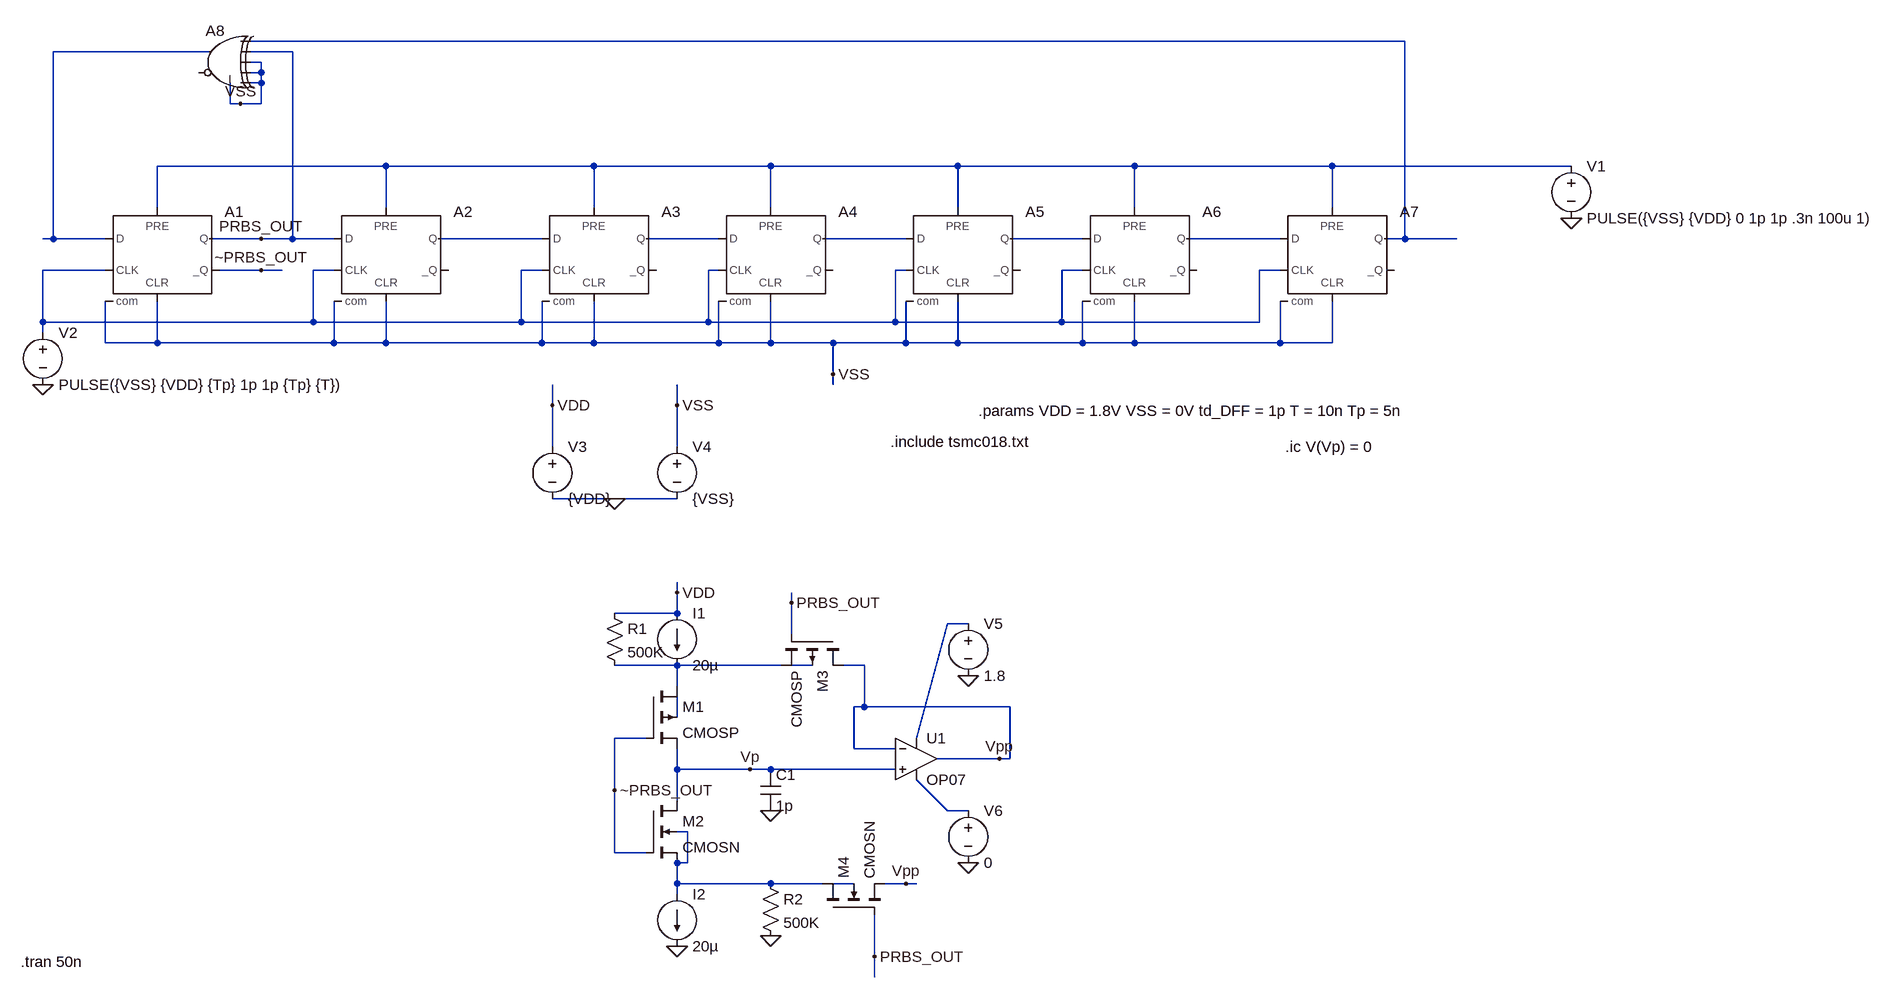
[diagram p0: schematic Current_Mode_Integrator1.asc]
Current_Mode_Integrator1.asc, the LTspice schematic file:
Version 4
SHEET 1 2280 1356
WIRE 1520 -160 -256 -160
WIRE -320 -144 -560 -144
WIRE -192 -144 -256 -144
WIRE -240 -128 -256 -128
WIRE -240 -112 -240 -128
WIRE -240 -112 -256 -112
WIRE -240 -96 -240 -112
WIRE -240 -96 -256 -96
WIRE -288 -64 -288 -96
WIRE -272 -64 -288 -64
WIRE -240 -64 -240 -96
WIRE -240 -64 -272 -64
WIRE -48 32 -400 32
WIRE 272 32 -48 32
WIRE 544 32 272 32
WIRE 832 32 544 32
WIRE 1104 32 832 32
WIRE 1408 32 1104 32
WIRE 1776 32 1408 32
WIRE -400 96 -400 32
WIRE -48 96 -48 32
WIRE 272 96 272 32
WIRE 544 96 544 32
WIRE 832 96 832 32
WIRE 1104 96 1104 32
WIRE 1408 96 1408 32
WIRE -560 144 -560 -144
WIRE -560 144 -576 144
WIRE -480 144 -560 144
WIRE -240 144 -320 144
WIRE -192 144 -192 -144
WIRE -192 144 -240 144
WIRE -128 144 -192 144
WIRE 192 144 32 144
WIRE 464 144 352 144
WIRE 752 144 624 144
WIRE 1024 144 912 144
WIRE 1328 144 1184 144
WIRE 1520 144 1520 -160
WIRE 1520 144 1488 144
WIRE 1600 144 1520 144
WIRE -480 192 -576 192
WIRE -240 192 -304 192
WIRE -208 192 -240 192
WIRE -128 192 -160 192
WIRE 192 192 160 192
WIRE 464 192 448 192
WIRE 752 192 736 192
WIRE 1024 192 992 192
WIRE 1328 192 1296 192
WIRE -576 272 -576 192
WIRE -160 272 -160 192
WIRE -160 272 -576 272
WIRE 160 272 160 192
WIRE 160 272 -160 272
WIRE 448 272 448 192
WIRE 448 272 160 272
WIRE 736 272 736 192
WIRE 736 272 448 272
WIRE 992 272 992 192
WIRE 992 272 736 272
WIRE 1296 272 1296 192
WIRE 1296 272 992 272
WIRE -576 288 -576 272
WIRE -480 304 -480 240
WIRE -400 304 -400 240
WIRE -400 304 -480 304
WIRE -128 304 -128 240
WIRE -128 304 -400 304
WIRE -48 304 -48 240
WIRE -48 304 -128 304
WIRE 192 304 192 240
WIRE 192 304 -48 304
WIRE 272 304 272 240
WIRE 272 304 192 304
WIRE 464 304 464 240
WIRE 464 304 272 304
WIRE 544 304 544 240
WIRE 544 304 464 304
WIRE 640 304 544 304
WIRE 752 304 752 240
WIRE 752 304 640 304
WIRE 832 304 832 240
WIRE 832 304 752 304
WIRE 1024 304 1024 240
WIRE 1024 304 832 304
WIRE 1104 304 1104 240
WIRE 1104 304 1024 304
WIRE 1328 304 1328 240
WIRE 1328 304 1104 304
WIRE 1408 304 1408 240
WIRE 1408 304 1328 304
WIRE 640 352 640 304
WIRE 640 368 640 352
WIRE 208 400 208 368
WIRE 400 400 400 368
WIRE 208 464 208 400
WIRE 400 464 400 400
WIRE 304 544 208 544
WIRE 400 544 304 544
WIRE 400 688 400 672
WIRE 576 704 576 688
WIRE 400 720 400 688
WIRE 400 720 304 720
WIRE 848 736 816 736
WIRE 576 752 576 704
WIRE 400 800 304 800
WIRE 560 800 400 800
WIRE 608 800 576 800
WIRE 688 800 656 800
WIRE 400 832 400 800
WIRE 688 864 688 800
WIRE 688 864 672 864
WIRE 912 864 688 864
WIRE 400 880 400 848
WIRE 352 912 304 912
WIRE 768 912 816 736
WIRE 672 928 672 864
WIRE 736 928 672 928
WIRE 896 944 800 944
WIRE 912 944 912 864
WIRE 912 944 896 944
WIRE 400 960 400 928
WIRE 512 960 400 960
WIRE 544 960 512 960
WIRE 736 960 544 960
WIRE 304 992 304 912
WIRE 400 1008 400 960
WIRE 816 1024 768 976
WIRE 848 1024 816 1024
WIRE 416 1056 400 1056
WIRE 304 1088 304 992
WIRE 352 1088 304 1088
WIRE 416 1104 416 1056
WIRE 416 1104 400 1104
WIRE 400 1136 400 1104
WIRE 544 1136 400 1136
WIRE 624 1136 544 1136
WIRE 672 1136 640 1136
WIRE 752 1136 720 1136
WIRE 768 1136 752 1136
WIRE 400 1152 400 1136
WIRE 704 1248 704 1184
WIRE 704 1280 704 1248
FLAG 1776 112 0
FLAG -576 368 0
FLAG -272 -64 VSS
FLAG 640 352 VSS
FLAG -240 144 PRBS_OUT
FLAG -240 192 ~PRBS_OUT
FLAG 304 544 0
FLAG 208 400 VDD
FLAG 400 400 VSS
FLAG 544 1024 0
FLAG 304 992 ~PRBS_OUT
FLAG 400 1232 0
FLAG 400 688 VDD
FLAG 512 960 Vp
FLAG 544 1216 0
FLAG 848 816 0
FLAG 848 1104 0
FLAG 896 944 Vpp
FLAG 752 1136 Vpp
FLAG 704 1248 PRBS_OUT
FLAG 576 704 PRBS_OUT
SYMBOL Digital\\dflop -400 96 R0
SYMATTR InstName A1
SYMATTR SpiceLine Trise = 1p Tfall = 1p Td = td_DFF
SYMATTR Value2 Vhigh = 1.8 Vlow = 0
SYMBOL Digital\\dflop -48 96 R0
SYMATTR InstName A2
SYMATTR SpiceLine Trise = 1p Tfall = 1p Td = td_DFF
SYMATTR Value2 Vhigh = 1.8 Vlow = 0
SYMBOL Digital\\dflop 272 96 R0
SYMATTR InstName A3
SYMATTR SpiceLine Trise = 1p Tfall = 1p Td = td_DFF
SYMATTR Value2 Vhigh = 1.8 Vlow = 0
SYMBOL Digital\\dflop 544 96 R0
SYMATTR InstName A4
SYMATTR SpiceLine Trise = 1p Tfall = 1p Td = td_DFF
SYMATTR Value2 Vhigh = 1.8 Vlow = 0
SYMBOL Digital\\dflop 832 96 R0
SYMATTR InstName A5
SYMATTR SpiceLine Trise = 1p Tfall = 1p Td = td_DFF
SYMATTR Value2 Vhigh = 1.8 Vlow = 0
SYMBOL Digital\\dflop 1104 96 R0
SYMATTR InstName A6
SYMATTR SpiceLine Trise = 1p Tfall = 1p Td = td_DFF
SYMATTR Value2 Vhigh = 1.8 Vlow = 0
SYMBOL Digital\\dflop 1408 96 R0
SYMATTR InstName A7
SYMATTR SpiceLine Trise = 1p Tfall = 1p Td = td_DFF
SYMATTR Value2 Vhigh = 1.8 Vlow = 0
SYMBOL Digital\\xor -304 -192 M0
SYMATTR InstName A8
SYMATTR Value2 Vhigh = 1.8 Vlow = 0
SYMBOL voltage 1776 16 R0
WINDOW 123 0 0 Left 0
WINDOW 39 0 0 Left 0
SYMATTR InstName V1
SYMATTR Value PULSE({VSS} {VDD} 0 1p 1p .3n 100u 1)
SYMBOL voltage -576 272 R0
WINDOW 123 0 0 Left 0
WINDOW 39 0 0 Left 0
SYMATTR InstName V2
SYMATTR Value PULSE({VSS} {VDD} {Tp} 1p 1p {Tp} {T})
SYMBOL voltage 208 448 R0
WINDOW 123 0 0 Left 0
WINDOW 39 0 0 Left 0
SYMATTR InstName V3
SYMATTR Value {VDD}
SYMBOL voltage 400 448 R0
WINDOW 123 0 0 Left 0
WINDOW 39 0 0 Left 0
SYMATTR InstName V4
SYMATTR Value {VSS}
SYMBOL current 400 720 R0
WINDOW 123 0 0 Left 0
WINDOW 39 0 0 Left 0
SYMATTR InstName I1
SYMATTR Value 20µ
SYMBOL current 400 1152 R0
WINDOW 123 0 0 Left 0
WINDOW 39 0 0 Left 0
SYMATTR InstName I2
SYMATTR Value 20µ
SYMBOL pmos4 352 832 R0
SYMATTR InstName M1
SYMATTR Value CMOSP
SYMATTR Value2 l=1u w=3u
SYMBOL nmos4 352 1008 R0
SYMATTR InstName M2
SYMATTR Value CMOSN
SYMATTR Value2 l=.5u w=3u
SYMBOL cap 528 960 R0
SYMATTR InstName C1
SYMATTR Value 1p
SYMBOL res 288 704 R0
SYMATTR InstName R1
SYMATTR Value 500K
SYMBOL res 528 1120 R0
SYMATTR InstName R2
SYMATTR Value 500K
SYMBOL Opamps\\OP07 768 880 R0
SYMATTR InstName U1
SYMBOL voltage 848 720 R0
WINDOW 123 0 0 Left 0
WINDOW 39 0 0 Left 0
SYMATTR InstName V5
SYMATTR Value 1.8
SYMBOL voltage 848 1008 R0
WINDOW 123 0 0 Left 0
WINDOW 39 0 0 Left 0
SYMATTR InstName V6
SYMATTR Value 0
SYMBOL pmos4 656 752 R90
SYMATTR InstName M3
SYMATTR Value CMOSP
SYMATTR Value2 l=0.5u w=3u
SYMBOL nmos4 624 1184 R270
SYMATTR InstName M4
SYMATTR Value CMOSN
SYMATTR Value2 l=0.5u w=3u
TEXT 864 408 Left 2 !.params VDD = 1.8V VSS = 0V td_DFF = 1p T = 10n Tp = 5n
TEXT 1336 464 Left 2 !.ic V(Vp) = 0
TEXT 728 456 Left 2 !.include tsmc018.txt
TEXT -610 1256 Left 2 !.tran 50n

The netlist it stands for:
* Current_Mode_Integrator1.asc
A1 N002 VSS N009 N003 VSS ~PRBS_OUT PRBS_OUT VSS DFLOP Vhigh = 1.8 Vlow = 0 Trise = 1p Tfall = 1p Td = td_DFF
A2 PRBS_OUT VSS N009 N003 VSS VSS N004 VSS DFLOP Vhigh = 1.8 Vlow = 0 Trise = 1p Tfall = 1p Td = td_DFF
A3 N004 VSS N009 N003 VSS VSS N005 VSS DFLOP Vhigh = 1.8 Vlow = 0 Trise = 1p Tfall = 1p Td = td_DFF
A4 N005 VSS N009 N003 VSS VSS N006 VSS DFLOP Vhigh = 1.8 Vlow = 0 Trise = 1p Tfall = 1p Td = td_DFF
A5 N006 VSS N009 N003 VSS VSS N007 VSS DFLOP Vhigh = 1.8 Vlow = 0 Trise = 1p Tfall = 1p Td = td_DFF
A6 N007 VSS N009 N003 VSS VSS N008 VSS DFLOP Vhigh = 1.8 Vlow = 0 Trise = 1p Tfall = 1p Td = td_DFF
A7 N008 VSS N009 N003 VSS VSS N001 VSS DFLOP Vhigh = 1.8 Vlow = 0 Trise = 1p Tfall = 1p Td = td_DFF
A8 N001 PRBS_OUT VSS VSS VSS VSS N002 VSS XOR Vhigh = 1.8 Vlow = 0
V1 N003 0 PULSE({VSS} {VDD} 0 1p 1p .3n 100u 1)
V2 N009 0 PULSE({VSS} {VDD} {Tp} 1p 1p {Tp} {T})
V3 VDD 0 {VDD}
V4 VSS 0 {VSS}
I1 VDD N011 20µ
I2 N015 0 20µ
M1 N011 ~PRBS_OUT Vp N013 CMOSP l=1u w=3u
M2 Vp ~PRBS_OUT N015 N015 CMOSN l=.5u w=3u
C1 Vp 0 1p
R1 VDD N011 500K
R2 N015 0 500K
XU1 Vp Vpp N010 N014 Vpp LT1001  ; OP07, pins In+ In- V+ V- OUT
V5 N010 0 1.8
V6 N014 0 0
M3 Vpp PRBS_OUT N011 N012 CMOSP l=0.5u w=3u
M4 N015 PRBS_OUT Vpp N016 CMOSN l=0.5u w=3u
.model NMOS NMOS
.model PMOS PMOS
.lib standard.mos
.params VDD = 1.8V VSS = 0V td_DFF = 1p T = 10n Tp = 5n
.ic V(Vp) = 0
.include tsmc018.txt
.tran 50n
.lib LTC.lib
.backanno
.end